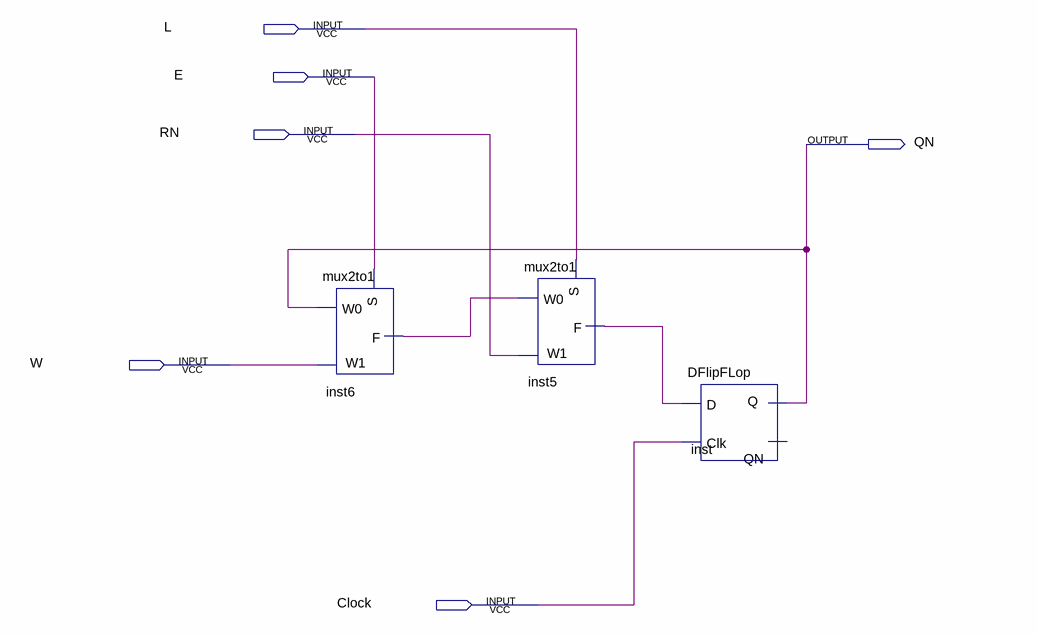
[diagram p0: schematic sheet]
// Quartus schematic Register-component.bdf as structural Verilog: 3 symbols, 6 pins
module \Register-component  (
  input  L,
  input  E,
  input  RN,
  input  W,
  input  Clock,
  output QN
);

  wire inst5_f, inst6_f;

  mux2to1 inst6 (.W0(QN), .W1(W), .S(E), .F(inst6_f));
  mux2to1 inst5 (.W0(inst6_f), .W1(RN), .S(L), .F(inst5_f));
  DFlipFLop inst (.D(inst5_f), .Clk(Clock), .Q(QN));  // open: QN
endmodule
